# EAGLE schematic BMS Segment rev15 (EAGLE 9.6.2)
ENGINEER: Arvind Srinivasan

## Sheet 1 of 4: Upper 9 Cell Connections and Cell Voltage Test Connection
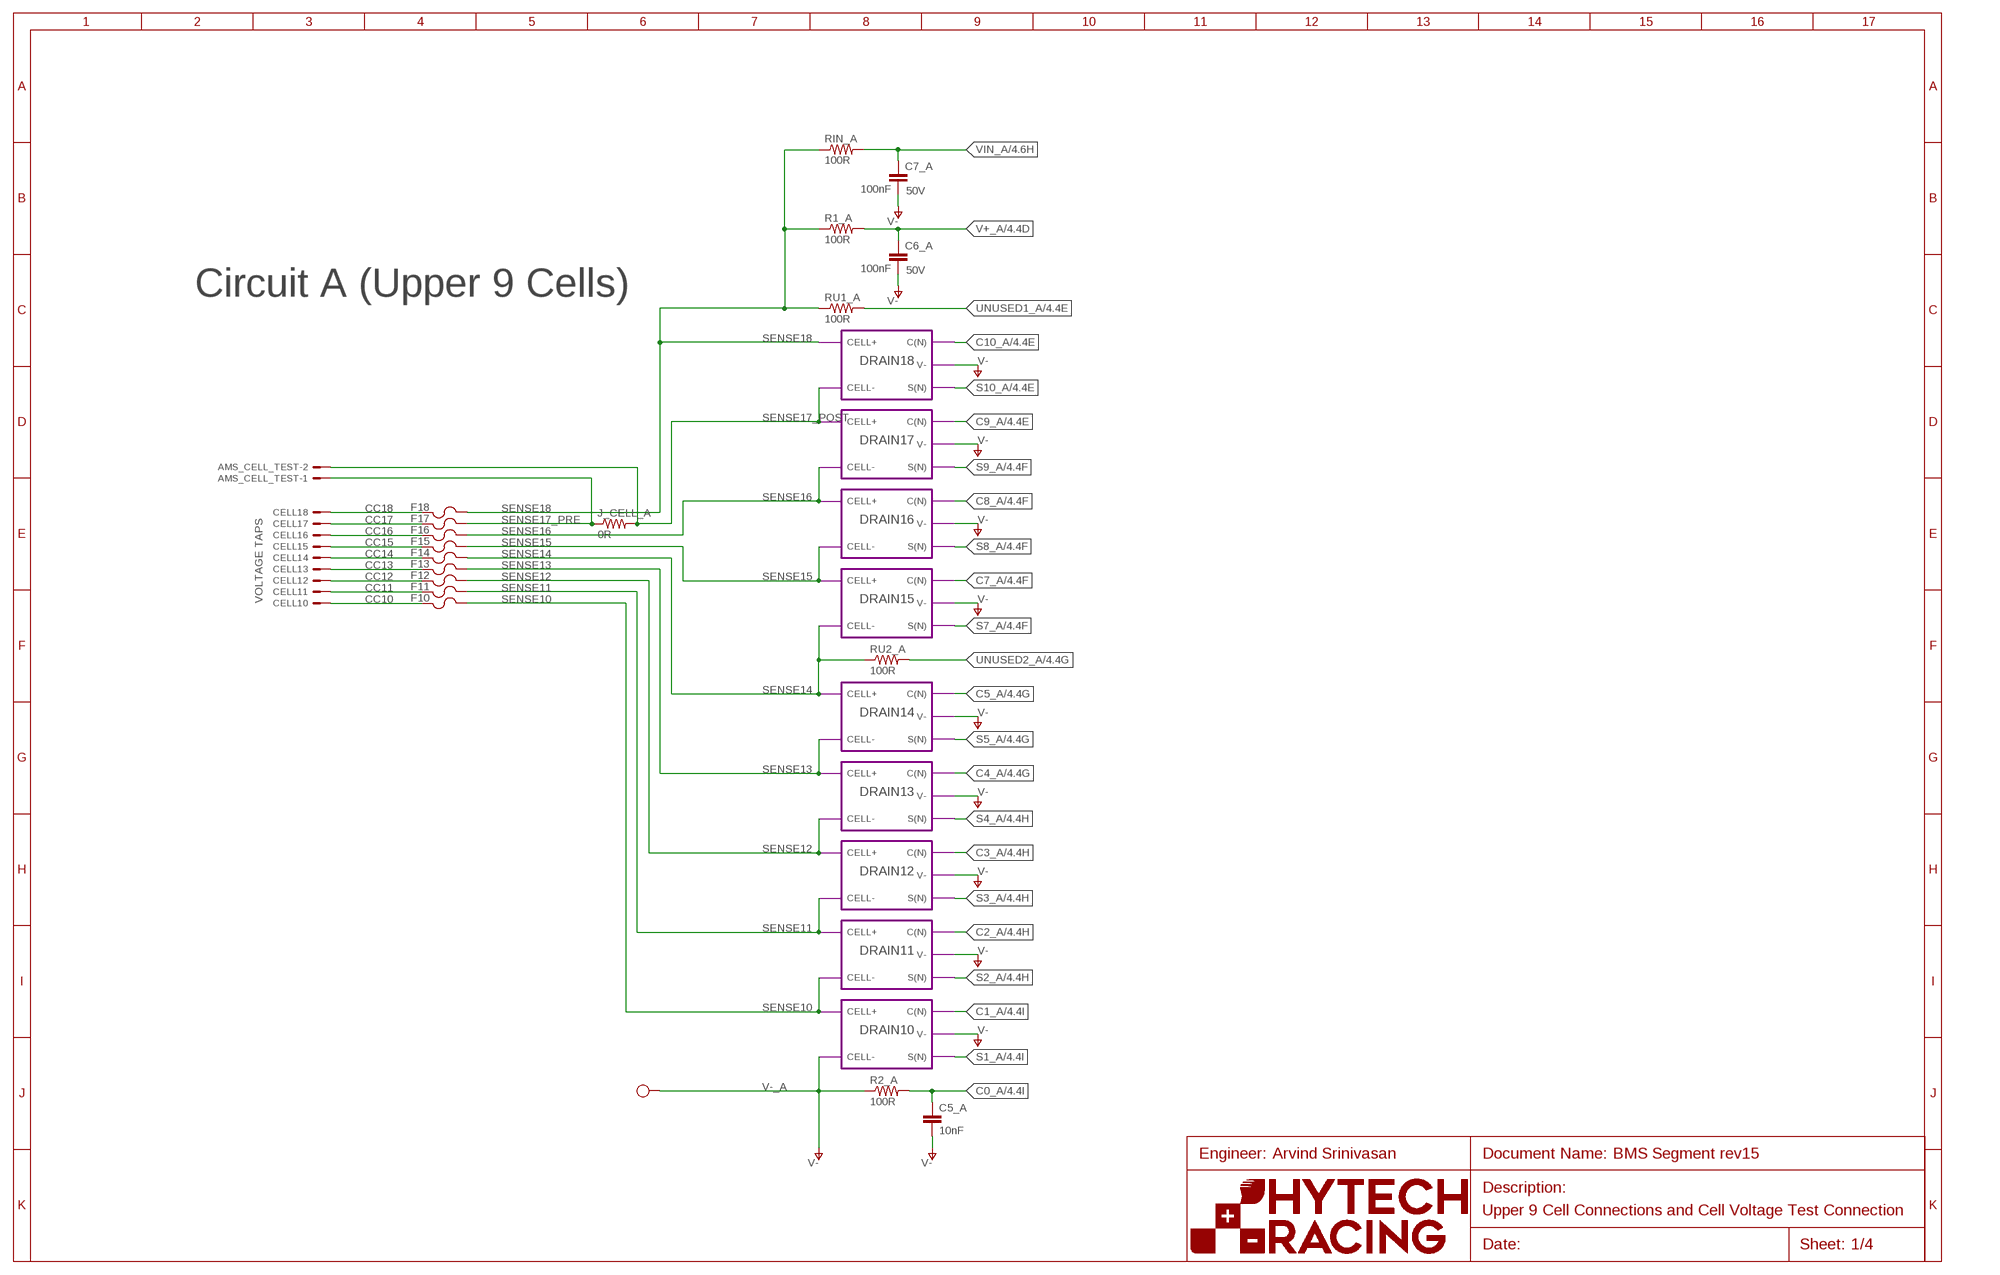
[diagram p0: schematic, sheet 1]
U$24 (FRAME_B): ENGINEER: Arvind Srinivasan; FRAME_DESCRIPTION: Upper 9 Cell Connections and Cell Voltage Test Connection; ORIENTATION: LANDSCAPE; SIZE: B

### Parts
AMS_CELL_TEST  AMS_CELL_TEST  CONNECTOR-2NANO-FIT_VERTICAL-2  [NANO-FIT_VERTICAL-2]
C5_A  10nF  CAP0603-CAP  [0603-CAP]
C6_A  100nF  CAP0603-CAP  [0603-CAP]
C7_A  100nF  CAP0603-CAP  [0603-CAP]
CELL10  BATTERY_SPRING_SPRING_CONTACT  [CONTACT_SPRING]
CELL11  BATTERY_SPRING_SPRING_CONTACT  [CONTACT_SPRING]
CELL12  BATTERY_SPRING_SPRING_CONTACT  [CONTACT_SPRING]
CELL13  BATTERY_SPRING_SPRING_CONTACT  [CONTACT_SPRING]
CELL14  BATTERY_SPRING_SPRING_CONTACT  [CONTACT_SPRING]
CELL15  BATTERY_SPRING_SPRING_CONTACT  [CONTACT_SPRING]
CELL16  BATTERY_SPRING_SPRING_CONTACT  [CONTACT_SPRING]
CELL17  BATTERY_SPRING_SPRING_CONTACT  [CONTACT_SPRING]
CELL18  BATTERY_SPRING_SPRING_CONTACT  [CONTACT_SPRING]
F10  0001.2704.11  [5X20MM_FUSE]
F11  0001.2704.11  [5X20MM_FUSE]
F12  0001.2704.11  [5X20MM_FUSE]
F13  0001.2704.11  [5X20MM_FUSE]
F14  0001.2704.11  [5X20MM_FUSE]
F15  0001.2704.11  [5X20MM_FUSE]
F16  0001.2704.11  [5X20MM_FUSE]
F17  0001.2704.11  [5X20MM_FUSE]
F18  0001.2704.11  [5X20MM_FUSE]
J_CELL_A  0R  RESISTOR0603-RES  [0603-RES]
R1_A  100R  RESISTOR0603-RES  [0603-RES]
R2_A  100R  RESISTOR0603-RES  [0603-RES]
RIN_A  100R  RESISTOR0603-RES  [0603-RES]
RU1_A  100R  RESISTOR0603-RES  [0603-RES]
RU2_A  100R  RESISTOR0603-RES  [0603-RES]
U$5  TEST_POINT  [TEST_POINT]

### Module instances
DRAIN10 = CELL_VOLTAGE_FILTER+DRAIN
DRAIN11 = CELL_VOLTAGE_FILTER+DRAIN
DRAIN12 = CELL_VOLTAGE_FILTER+DRAIN
DRAIN13 = CELL_VOLTAGE_FILTER+DRAIN
DRAIN14 = CELL_VOLTAGE_FILTER+DRAIN
DRAIN15 = CELL_VOLTAGE_FILTER+DRAIN
DRAIN16 = CELL_VOLTAGE_FILTER+DRAIN
DRAIN17 = CELL_VOLTAGE_FILTER+DRAIN
DRAIN18 = CELL_VOLTAGE_FILTER+DRAIN

### Nets
C0_A: C5_A.1 R2_A.2 ; also sheet 4
C1_A: port DRAIN10.C(N) ; also sheet 4
C2_A: port DRAIN11.C(N) ; also sheet 4
C3_A: port DRAIN12.C(N) ; also sheet 4
C4_A: port DRAIN13.C(N) ; also sheet 4
C5_A: port DRAIN14.C(N) ; also sheet 4
C7_A: port DRAIN15.C(N) ; also sheet 4
C8_A: port DRAIN16.C(N) ; also sheet 4
C9_A: port DRAIN17.C(N) ; also sheet 4
C10_A: port DRAIN18.C(N) ; also sheet 4
CC10 [unfused_hv]: CELL10.P$1(S) F10.P$1
CC11 [unfused_hv]: CELL11.P$1(S) F11.P$1
CC12 [unfused_hv]: CELL12.P$1(S) F12.P$1
CC13 [unfused_hv]: CELL13.P$1(S) F13.P$1
CC14 [unfused_hv]: CELL14.P$1(S) F14.P$1
CC15 [unfused_hv]: CELL15.P$1(S) F15.P$1
CC16 [unfused_hv]: CELL16.P$1(S) F16.P$1
CC17 [unfused_hv]: CELL17.P$1(S) F17.P$1
CC18 [unfused_hv]: CELL18.P$1(S) F18.P$1
S1_A: port DRAIN10.S(N) ; also sheet 4
S2_A: port DRAIN11.S(N) ; also sheet 4
S3_A: port DRAIN12.S(N) ; also sheet 4
S4_A: port DRAIN13.S(N) ; also sheet 4
S5_A: port DRAIN14.S(N) ; also sheet 4
S7_A: port DRAIN15.S(N) ; also sheet 4
S8_A: port DRAIN16.S(N) ; also sheet 4
S9_A: port DRAIN17.S(N) ; also sheet 4
S10_A: port DRAIN18.S(N) ; also sheet 4
SENSE10: F10.P$2 ; port DRAIN10.CELL+ DRAIN11.CELL-
SENSE11: F11.P$2 ; port DRAIN11.CELL+ DRAIN12.CELL-
SENSE12: F12.P$2 ; port DRAIN12.CELL+ DRAIN13.CELL-
SENSE13: F13.P$2 ; port DRAIN13.CELL+ DRAIN14.CELL-
SENSE14: F14.P$2 RU2_A.1 ; port DRAIN14.CELL+ DRAIN15.CELL-
SENSE15: F15.P$2 ; port DRAIN15.CELL+ DRAIN16.CELL-
SENSE16: F16.P$2 ; port DRAIN16.CELL+ DRAIN17.CELL-
SENSE17_POST: AMS_CELL_TEST.P$2 J_CELL_A.2 ; port DRAIN17.CELL+ DRAIN18.CELL-
SENSE17_PRE: AMS_CELL_TEST.P$1 F17.P$2 J_CELL_A.1
SENSE18: F18.P$2 R1_A.1 RIN_A.1 RU1_A.1 ; port DRAIN18.CELL+
UNUSED1_A: RU1_A.2 ; also sheet 4
UNUSED2_A: RU2_A.2 ; also sheet 4
V+_A: C6_A.1 R1_A.2 ; also sheet 4
V-_A: C5_A.2 C6_A.2 C7_A.2 R2_A.1 U$5.P$1 ; port DRAIN18.V- DRAIN17.V- DRAIN16.V- DRAIN15.V- DRAIN14.V- DRAIN13.V- DRAIN12.V- DRAIN11.V- DRAIN10.V- DRAIN10.CELL- ; supply symbol labelled V- ; also sheet 2,4
VIN_A: C7_A.1 RIN_A.2 ; also sheet 4

### Notes on the sheet
- Circuit A (Upper 9 Cells)
- VOLTAGE TAPS

## Sheet 2 of 4: Lower 9 Cell Connections
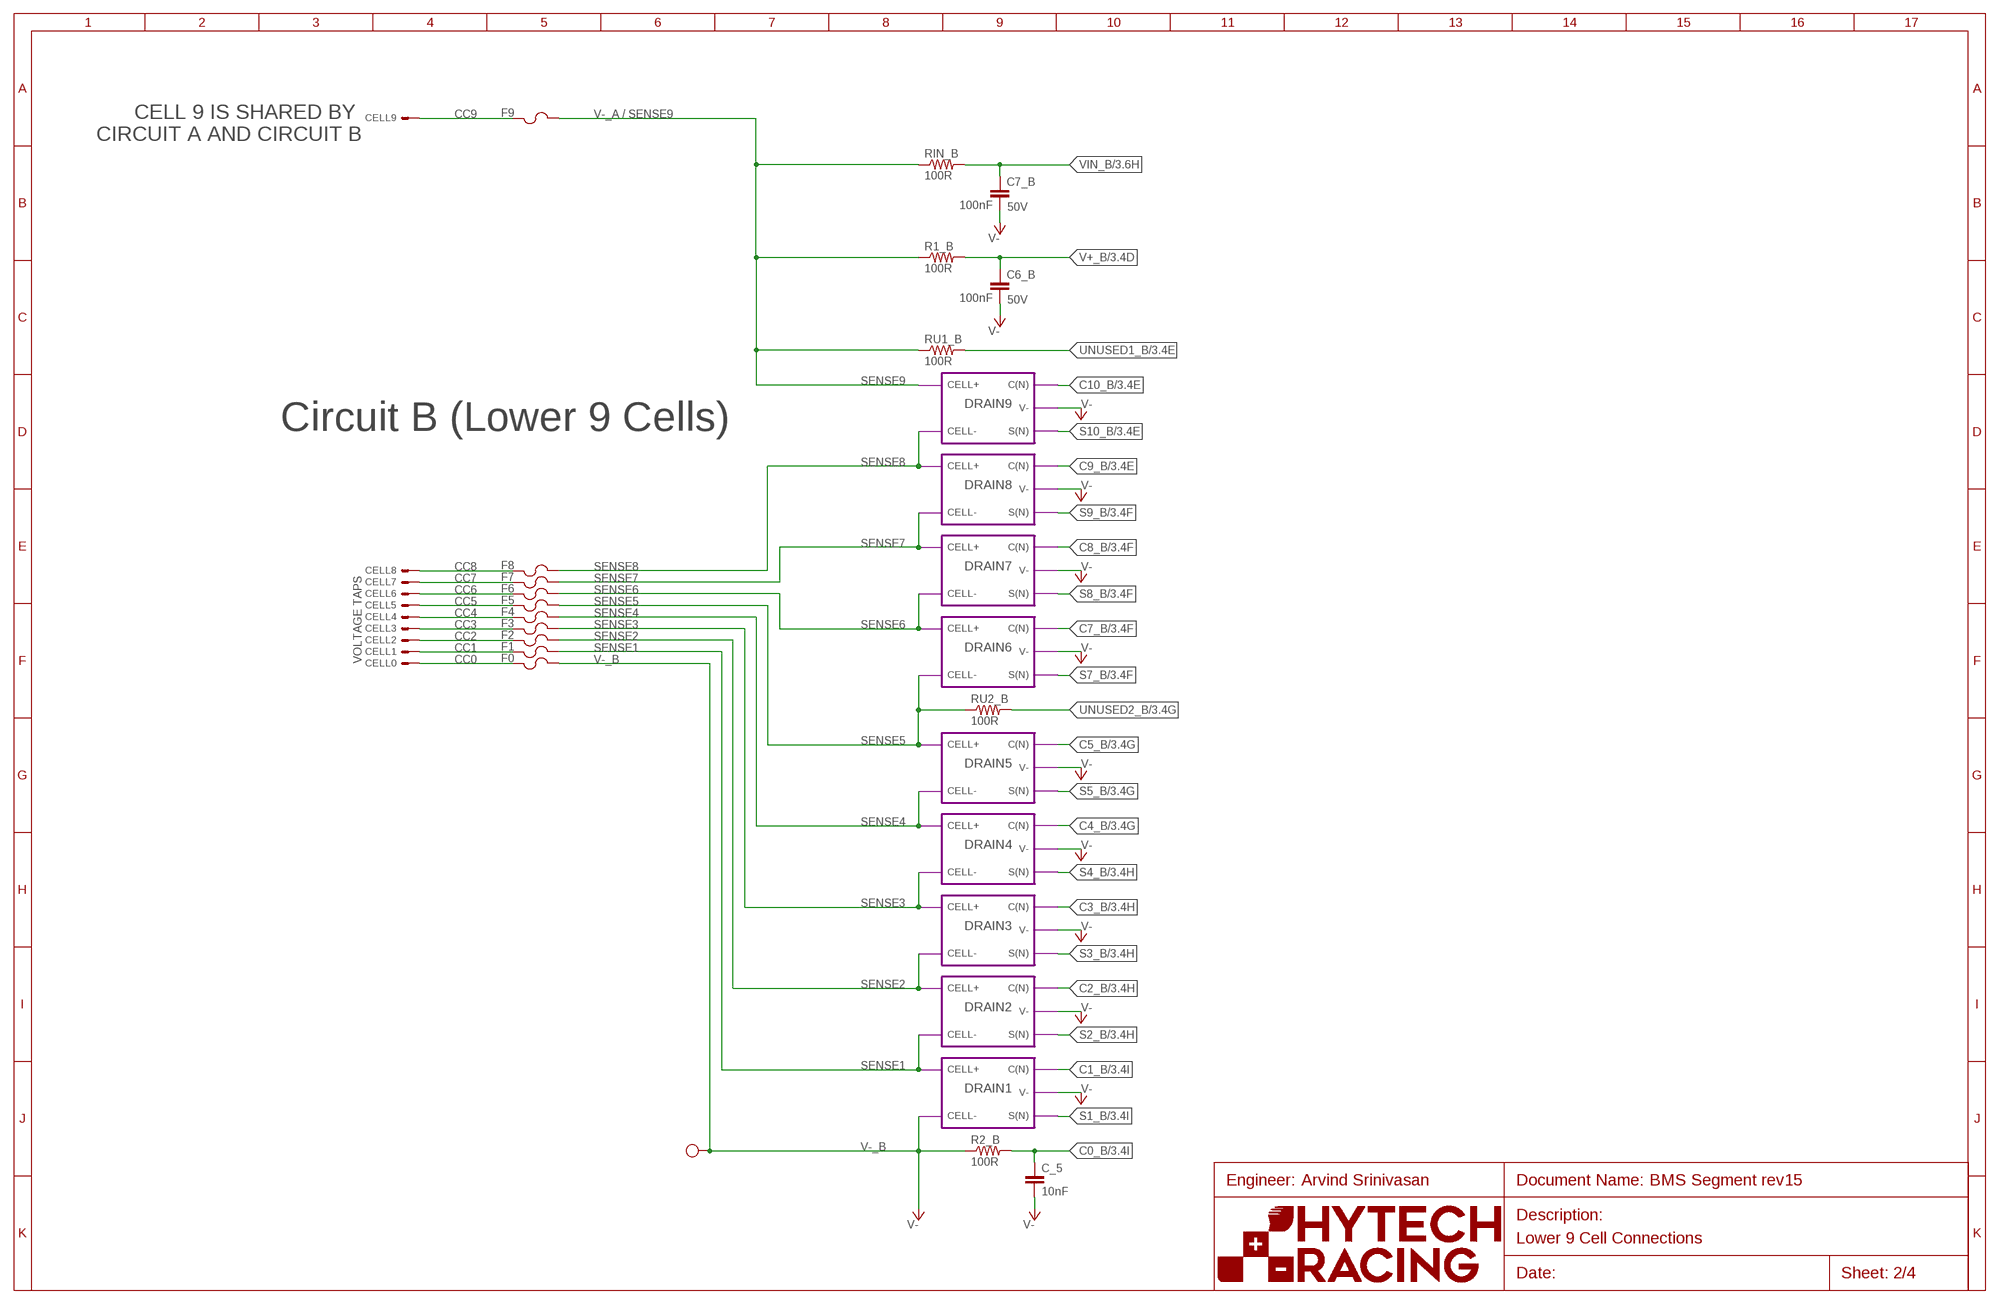
[diagram p1: schematic, sheet 2]
U$25 (FRAME_B): ENGINEER: Arvind Srinivasan; FRAME_DESCRIPTION: Lower 9 Cell Connections; ORIENTATION: LANDSCAPE; SIZE: B

### Parts
C6_B  100nF  CAP0603-CAP  [0603-CAP]
C7_B  100nF  CAP0603-CAP  [0603-CAP]
C_5  10nF  CAP0603-CAP  [0603-CAP]
CELL0  BATTERY_SPRING_SPRING_CONTACT  [CONTACT_SPRING]
CELL1  BATTERY_SPRING_SPRING_CONTACT  [CONTACT_SPRING]
CELL2  BATTERY_SPRING_SPRING_CONTACT  [CONTACT_SPRING]
CELL3  BATTERY_SPRING_SPRING_CONTACT  [CONTACT_SPRING]
CELL4  BATTERY_SPRING_SPRING_CONTACT  [CONTACT_SPRING]
CELL5  BATTERY_SPRING_SPRING_CONTACT  [CONTACT_SPRING]
CELL6  BATTERY_SPRING_SPRING_CONTACT  [CONTACT_SPRING]
CELL7  BATTERY_SPRING_SPRING_CONTACT  [CONTACT_SPRING]
CELL8  BATTERY_SPRING_SPRING_CONTACT  [CONTACT_SPRING]
CELL9  BATTERY_SPRING_SPRING_CONTACT  [CONTACT_SPRING]
F0  0001.2704.11  [5X20MM_FUSE]
F1  0001.2704.11  [5X20MM_FUSE]
F2  0001.2704.11  [5X20MM_FUSE]
F3  0001.2704.11  [5X20MM_FUSE]
F4  0001.2704.11  [5X20MM_FUSE]
F5  0001.2704.11  [5X20MM_FUSE]
F6  0001.2704.11  [5X20MM_FUSE]
F7  0001.2704.11  [5X20MM_FUSE]
F8  0001.2704.11  [5X20MM_FUSE]
F9  0001.2704.11  [5X20MM_FUSE]
R1_B  100R  RESISTOR0603-RES  [0603-RES]
R2_B  100R  RESISTOR0603-RES  [0603-RES]
RIN_B  100R  RESISTOR0603-RES  [0603-RES]
RU1_B  100R  RESISTOR0603-RES  [0603-RES]
RU2_B  100R  RESISTOR0603-RES  [0603-RES]
U$6  TEST_POINT  [TEST_POINT]

### Module instances
DRAIN1 = CELL_VOLTAGE_FILTER+DRAIN
DRAIN2 = CELL_VOLTAGE_FILTER+DRAIN
DRAIN3 = CELL_VOLTAGE_FILTER+DRAIN
DRAIN4 = CELL_VOLTAGE_FILTER+DRAIN
DRAIN5 = CELL_VOLTAGE_FILTER+DRAIN
DRAIN6 = CELL_VOLTAGE_FILTER+DRAIN
DRAIN7 = CELL_VOLTAGE_FILTER+DRAIN
DRAIN8 = CELL_VOLTAGE_FILTER+DRAIN
DRAIN9 = CELL_VOLTAGE_FILTER+DRAIN

### Nets
C0_B: C_5.1 R2_B.2 ; also sheet 3
C1_B: port DRAIN1.C(N) ; also sheet 3
C2_B: port DRAIN2.C(N) ; also sheet 3
C3_B: port DRAIN3.C(N) ; also sheet 3
C4_B: port DRAIN4.C(N) ; also sheet 3
C5_B: port DRAIN5.C(N) ; also sheet 3
C7_B: port DRAIN6.C(N) ; also sheet 3
C8_B: port DRAIN7.C(N) ; also sheet 3
C9_B: port DRAIN8.C(N) ; also sheet 3
C10_B: port DRAIN9.C(N) ; also sheet 3
CC0 [unfused_hv]: CELL0.P$1(S) F0.P$1
CC1 [unfused_hv]: CELL1.P$1(S) F1.P$1
CC2 [unfused_hv]: CELL2.P$1(S) F2.P$1
CC3 [unfused_hv]: CELL3.P$1(S) F3.P$1
CC4 [unfused_hv]: CELL4.P$1(S) F4.P$1
CC5 [unfused_hv]: CELL5.P$1(S) F5.P$1
CC6 [unfused_hv]: CELL6.P$1(S) F6.P$1
CC7 [unfused_hv]: CELL7.P$1(S) F7.P$1
CC8 [unfused_hv]: CELL8.P$1(S) F8.P$1
CC9 [unfused_hv]: CELL9.P$1(S) F9.P$1
S1_B: port DRAIN1.S(N) ; also sheet 3
S2_B: port DRAIN2.S(N) ; also sheet 3
S3_B: port DRAIN3.S(N) ; also sheet 3
S4_B: port DRAIN4.S(N) ; also sheet 3
S5_B: port DRAIN5.S(N) ; also sheet 3
S7_B: port DRAIN6.S(N) ; also sheet 3
S8_B: port DRAIN7.S(N) ; also sheet 3
S9_B: port DRAIN8.S(N) ; also sheet 3
S10_B: port DRAIN9.S(N) ; also sheet 3
SENSE1: F1.P$2 ; port DRAIN1.CELL+ DRAIN2.CELL-
SENSE2: F2.P$2 ; port DRAIN2.CELL+ DRAIN3.CELL-
SENSE3: F3.P$2 ; port DRAIN3.CELL+ DRAIN4.CELL-
SENSE4: F4.P$2 ; port DRAIN4.CELL+ DRAIN5.CELL-
SENSE5: F5.P$2 RU2_B.1 ; port DRAIN5.CELL+ DRAIN6.CELL-
SENSE6: F6.P$2 ; port DRAIN6.CELL+ DRAIN7.CELL-
SENSE7: F7.P$2 ; port DRAIN7.CELL+ DRAIN8.CELL-
SENSE8: F8.P$2 ; port DRAIN8.CELL+ DRAIN9.CELL-
UNUSED1_B: RU1_B.2 ; also sheet 3
UNUSED2_B: RU2_B.2 ; also sheet 3
V+_B: C6_B.1 R1_B.2 ; also sheet 3
V-_A: F9.P$2 R1_B.1 RIN_B.1 RU1_B.1 ; port DRAIN9.CELL+ ; also sheet 1,4
V-_B: C6_B.2 C7_B.2 C_5.2 F0.P$2 R2_B.1 U$6.P$1 ; port DRAIN1.CELL- DRAIN9.V- DRAIN8.V- DRAIN7.V- DRAIN6.V- DRAIN5.V- DRAIN4.V- DRAIN3.V- DRAIN2.V- DRAIN1.V- ; supply symbol labelled V- ; also sheet 3
VIN_B: C7_B.1 RIN_B.2 ; also sheet 3

### Notes on the sheet
- V-_A / SENSE9
- CELL 9 IS SHARED BY 
  CIRCUIT A AND CIRCUIT B
- SENSE9
- Circuit B (Lower 9 Cells)
- VOLTAGE TAPS

## Sheet 3 of 4: Upper LTC6811 IC
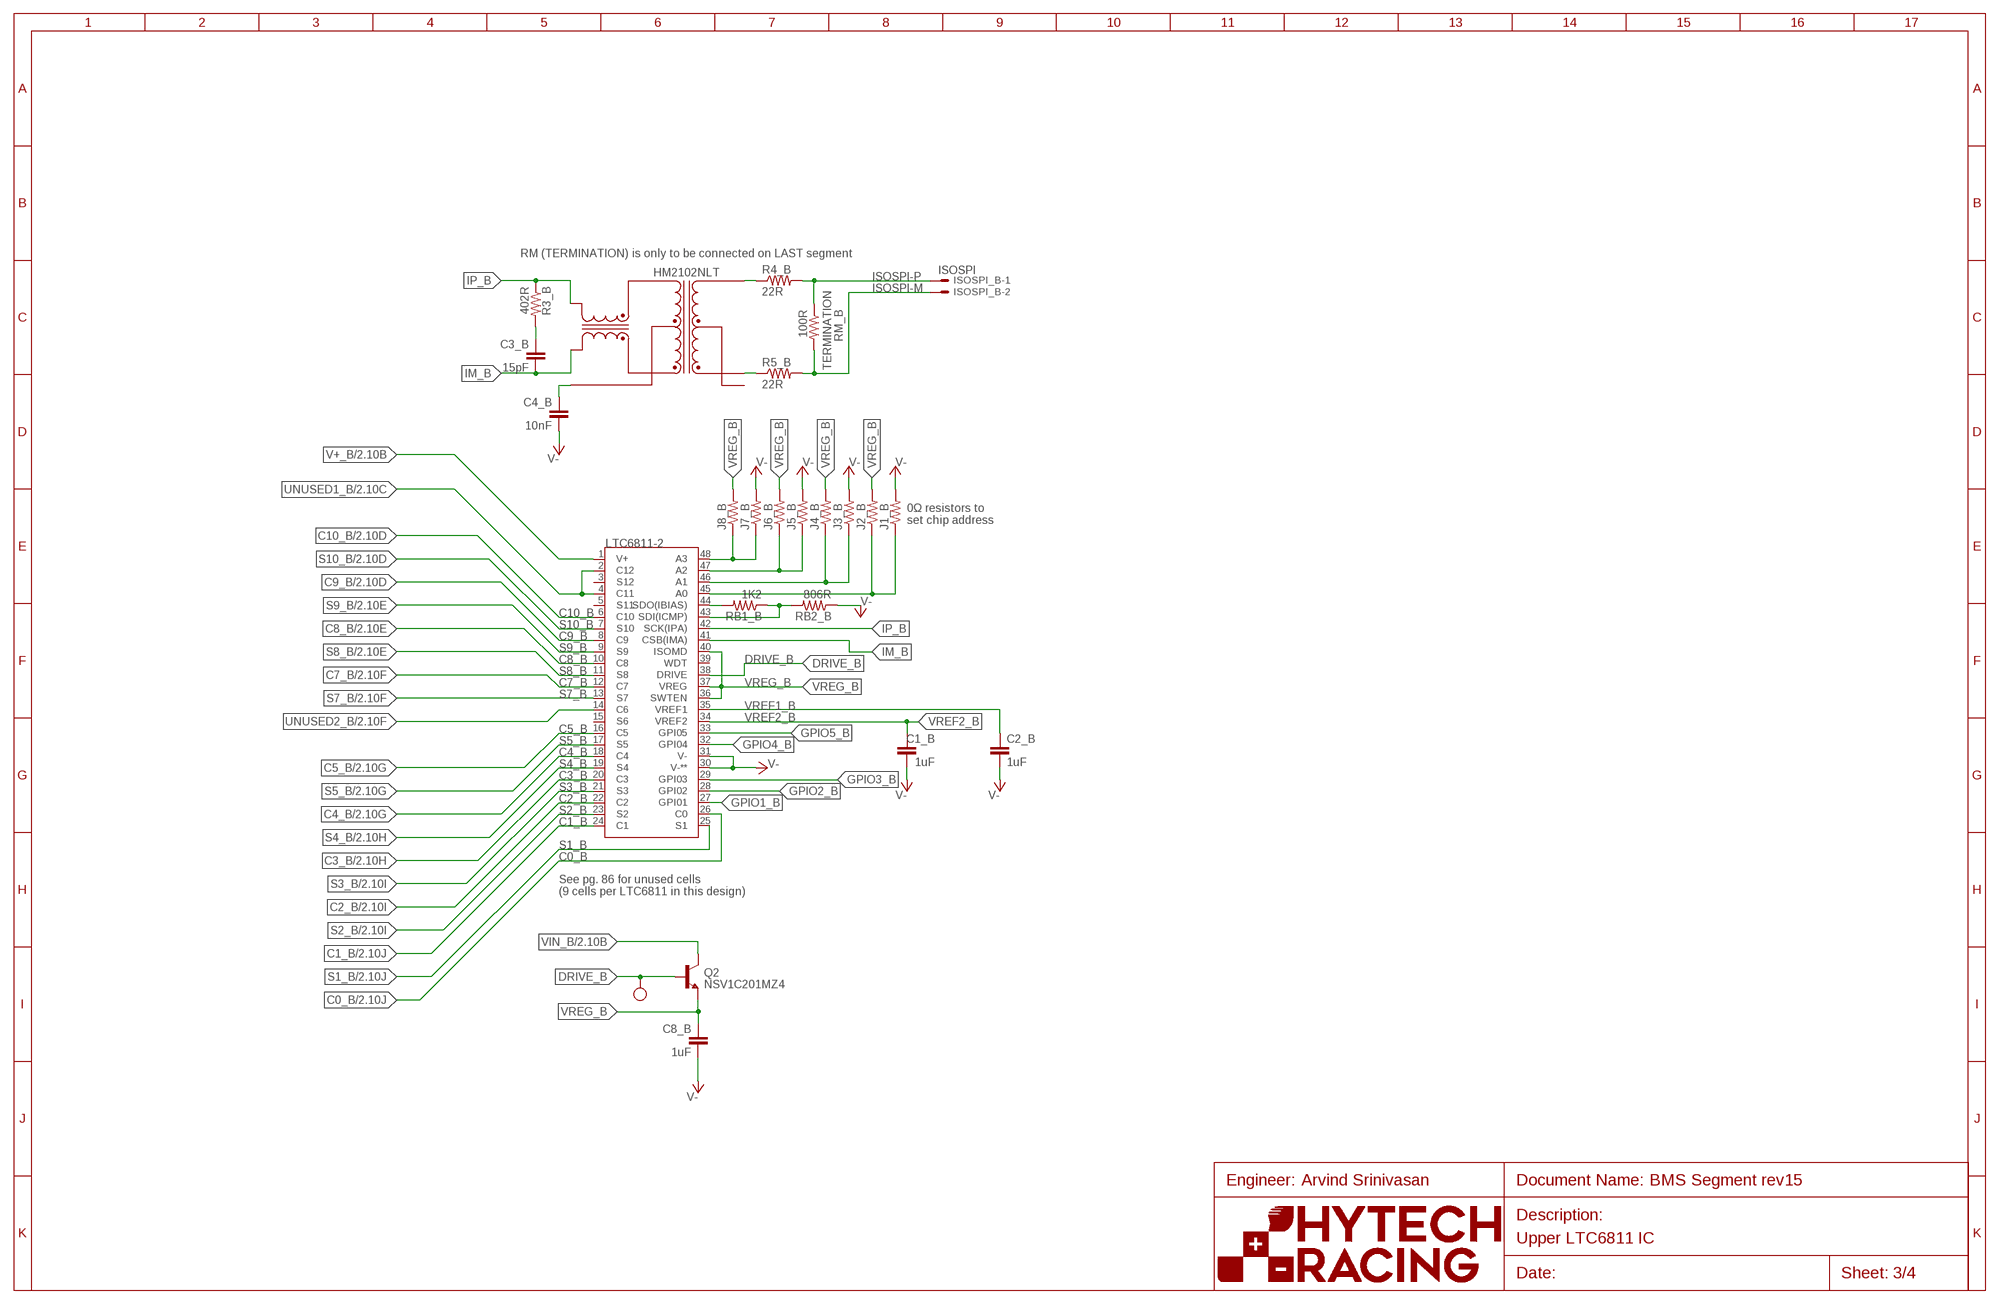
[diagram p2: schematic, sheet 3]
U$22 (FRAME_B): ENGINEER: Arvind Srinivasan; FRAME_DESCRIPTION: Upper LTC6811 IC; ORIENTATION: LANDSCAPE; SIZE: B

### Parts
C1_B  1uF  CAP0603-CAP  [0603-CAP]
C2_B  1uF  CAP0603-CAP  [0603-CAP]
C3_B  15pF  CAP0603-CAP  [0603-CAP]
C4_B  10nF  CAP0603-CAP  [0603-CAP]
C8_B  1uF  CAP0603-CAP  [0603-CAP]
ISOSPI_B  ISOSPI  CONNECTOR-2NANO-FIT_VERTICAL-2  [NANO-FIT_VERTICAL-2]
J1_B  0R  RESISTOR0603-RES  [0603-RES]
J2_B  0R  RESISTOR0603-RES  [0603-RES]
J3_B  0R  RESISTOR0603-RES  [0603-RES]
J4_B  0R  RESISTOR0603-RES  [0603-RES]
J5_B  0R  RESISTOR0603-RES  [0603-RES]
J6_B  0R  RESISTOR0603-RES  [0603-RES]
J7_B  0R  RESISTOR0603-RES  [0603-RES]
J8_B  0R  RESISTOR0603-RES  [0603-RES]
Q2  NSV1C201MZ4  [SOT223]
R3_B  402R  RESISTOR0603-RES  [0603-RES]
R4_B  22R  RESISTOR0603-RES  [0603-RES]
R5_B  22R  RESISTOR0603-RES  [0603-RES]
RB1_B  1K2  RESISTOR0603-RES  [0603-RES]
RB2_B  806R  RESISTOR0603-RES  [0603-RES]
RM_B  100R  RESISTOR0603-RES  [0603-RES]
TRANSFORMER  HM2102NLT  [HM2102NLT]
U2  LTC6811-2  [LTC6811]
U$7  TEST_POINT  [TEST_POINT]

### Nets
C0_B: U2.26(C0) ; also sheet 2
C1_B: U2.24(C1) ; also sheet 2
C2_B: U2.22(C2) ; also sheet 2
C3_B: U2.20(C3) ; also sheet 2
C4_B: U2.18(C4) ; also sheet 2
C5_B: U2.16(C5) ; also sheet 2
C7_B: U2.12(C7) ; also sheet 2
C8_B: U2.10(C8) ; also sheet 2
C9_B: U2.8(C9) ; also sheet 2
C10_B: U2.6(C10) ; also sheet 2
DRIVE_B: Q2.1(BASE) U2.38(DRIVE) U$7.P$1
GPIO1_B: U2.27(GPI01)
GPIO2_B: U2.28(GPI02)
GPIO3_B: U2.29(GPI03)
GPIO4_B: U2.32(GPI04)
GPIO5_B: U2.33(GPI05)
IM_B: C3_B.2 TRANSFORMER.P$12(TD+) U2.41(CSB(IMA))
IP_B: R3_B.1 TRANSFORMER.P$10(TD-) U2.42(SCK(IPA))
ISOSPI-M: ISOSPI_B.P$2 R5_B.2 RM_B.2 ; also sheet 4
ISOSPI-P: ISOSPI_B.P$1 R4_B.2 RM_B.1 ; also sheet 4
N$1: C4_B.1 TRANSFORMER.P$11(TCT)
N$2: RB1_B.2 U2.44(SDO(IBIAS))
N$4: RB1_B.1 RB2_B.2 U2.43(SDI(ICMP))
N$5: R4_B.1 TRANSFORMER.P$3(MX-)
N$7: R5_B.1 TRANSFORMER.P$1(MX+)
N$8: J7_B.1 J8_B.1 U2.48(A3)
N$9: J5_B.1 J6_B.1 U2.47(A2)
N$10: C3_B.1 R3_B.2
N$13: J3_B.1 J4_B.1 U2.46(A1)
N$16: J1_B.1 J2_B.1 U2.45(A0)
S1_B: U2.25(S1) ; also sheet 2
S2_B: U2.23(S2) ; also sheet 2
S3_B: U2.21(S3) ; also sheet 2
S4_B: U2.19(S4) ; also sheet 2
S5_B: U2.17(S5) ; also sheet 2
S7_B: U2.13(S7) ; also sheet 2
S8_B: U2.11(S8) ; also sheet 2
S9_B: U2.9(S9) ; also sheet 2
S10_B: U2.7(S10) ; also sheet 2
UNUSED1_B: U2.2(C12) U2.4(C11) ; also sheet 2
UNUSED2_B: U2.14(C6) ; also sheet 2
V+_B: U2.1(V+) ; also sheet 2
V-_B: C1_B.2 C2_B.2 C4_B.2 C8_B.2 J1_B.2 J3_B.2 J5_B.2 J7_B.2 RB2_B.1 U2.30(V-**) U2.31(V-) ; supply symbol labelled V- ; also sheet 2
VIN_B: Q2.2(COLLECTOR) Q2.4(COLLECTOR) ; also sheet 2
VREF1_B: C2_B.1 U2.35(VREF1)
VREF2_B: C1_B.1 U2.34(VREF2)
VREG_B: C8_B.1 J2_B.2 J4_B.2 J6_B.2 J8_B.2 Q2.3(EMITTER) U2.36(SWTEN) U2.37(VREG) U2.40(ISOMD)
Unconnected: TRANSFORMER.P$2(MCT) U2.3(S12) U2.5(S11) U2.15(S6) U2.39(WDT)

### Notes on the sheet
- RM (TERMINATION) is only to be connected on LAST segment
- 0Ω resistors to
  set chip address
- LTC6811-2
- See pg. 86 for unused cells
  (9 cells per LTC6811 in this design)

## Sheet 4 of 4: Lower LTC6811 IC and Cell Thermistor Test Connection
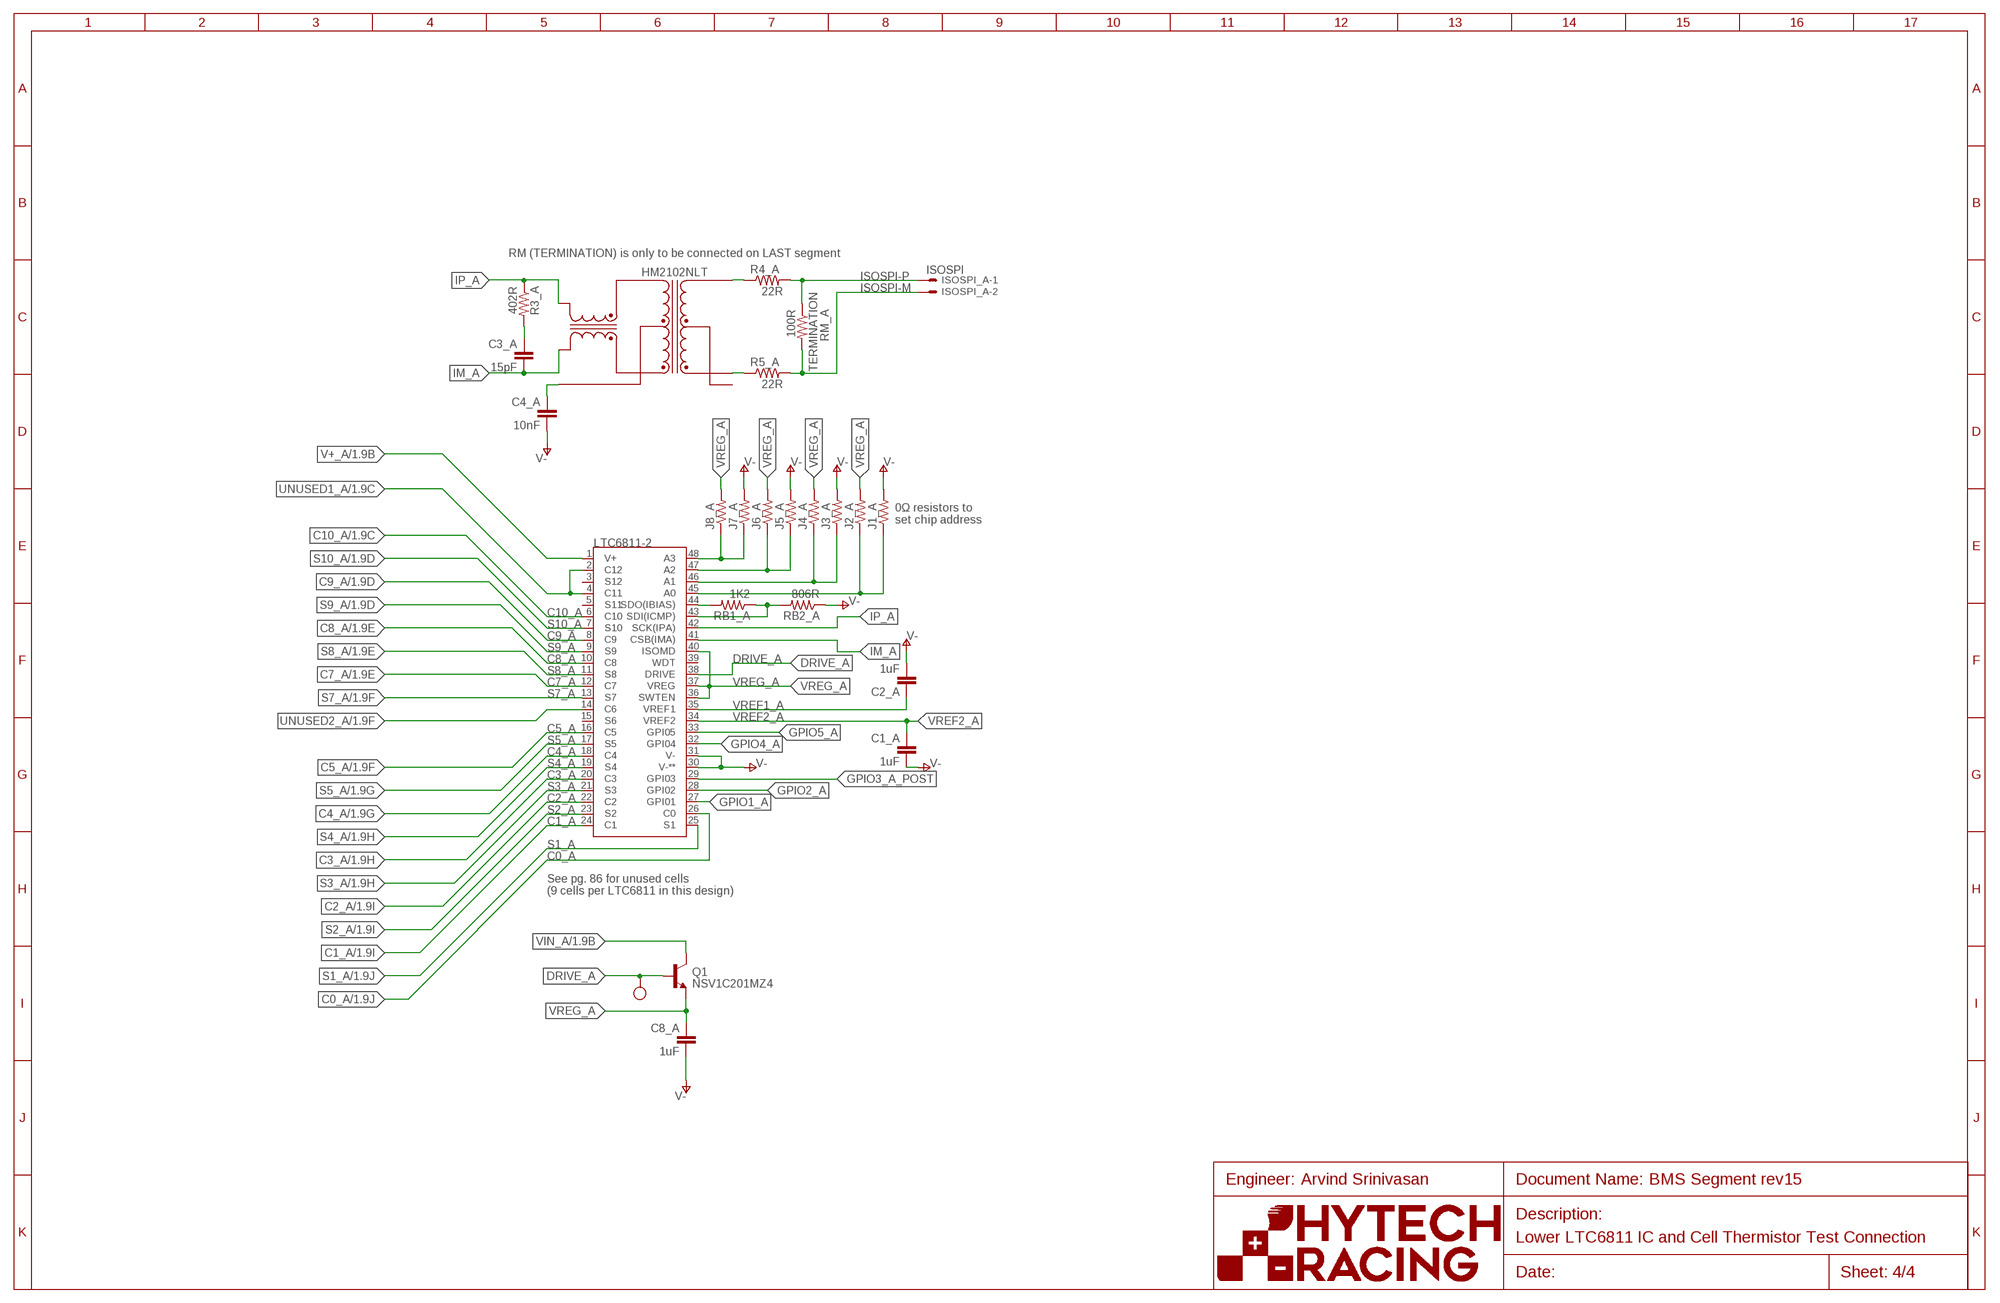
[diagram p3: schematic, sheet 4]
U$23 (FRAME_B): ENGINEER: Arvind Srinivasan; FRAME_DESCRIPTION: Lower LTC6811 IC and Cell Thermistor Test Connection; ORIENTATION: LANDSCAPE; SIZE: B

### Parts
C1_A  1uF  CAP0603-CAP  [0603-CAP]
C2_A  1uF  CAP0603-CAP  [0603-CAP]
C3_A  15pF  CAP0603-CAP  [0603-CAP]
C4_A  10nF  CAP0603-CAP  [0603-CAP]
C8_A  1uF  CAP0603-CAP  [0603-CAP]
ISOSPI_A  ISOSPI  CONNECTOR-2NANO-FIT_VERTICAL-2  [NANO-FIT_VERTICAL-2]
J1_A  0R  RESISTOR0603-RES  [0603-RES]
J2_A  0R  RESISTOR0603-RES  [0603-RES]
J3_A  0R  RESISTOR0603-RES  [0603-RES]
J4_A  0R  RESISTOR0603-RES  [0603-RES]
J5_A  0R  RESISTOR0603-RES  [0603-RES]
J6_A  0R  RESISTOR0603-RES  [0603-RES]
J7_A  0R  RESISTOR0603-RES  [0603-RES]
J8_A  0R  RESISTOR0603-RES  [0603-RES]
Q1  NSV1C201MZ4  [SOT223]
R3_A  402R  RESISTOR0603-RES  [0603-RES]
R4_A  22R  RESISTOR0603-RES  [0603-RES]
R5_A  22R  RESISTOR0603-RES  [0603-RES]
RB1_A  1K2  RESISTOR0603-RES  [0603-RES]
RB2_A  806R  RESISTOR0603-RES  [0603-RES]
RM_A  100R  RESISTOR0603-RES  [0603-RES]
U1  LTC6811-2  [LTC6811]
U$8  TEST_POINT  [TEST_POINT]

### Nets
C0_A: U1.26(C0) ; also sheet 1
C1_A: U1.24(C1) ; also sheet 1
C2_A: U1.22(C2) ; also sheet 1
C3_A: U1.20(C3) ; also sheet 1
C4_A: U1.18(C4) ; also sheet 1
C5_A: U1.16(C5) ; also sheet 1
C7_A: U1.12(C7) ; also sheet 1
C8_A: U1.10(C8) ; also sheet 1
C9_A: U1.8(C9) ; also sheet 1
C10_A: U1.6(C10) ; also sheet 1
DRIVE_A: Q1.1(BASE) U1.38(DRIVE) U$8.P$1
GPIO1_A: U1.27(GPI01)
GPIO2_A: U1.28(GPI02)
GPIO3_A_POST: U1.29(GPI03)
GPIO4_A: U1.32(GPI04)
GPIO5_A: U1.33(GPI05)
IM_A: C3_A.2 TRANSFORMER.P$9(TD+) U1.41(CSB(IMA))
IP_A: R3_A.1 TRANSFORMER.P$7(TD-) U1.42(SCK(IPA))
ISOSPI-M: ISOSPI_A.P$2 R5_A.2 RM_A.2 ; also sheet 3
ISOSPI-P: ISOSPI_A.P$1 R4_A.2 RM_A.1 ; also sheet 3
N$6: RB1_A.2 U1.44(SDO(IBIAS))
N$20: RB1_A.1 RB2_A.2 U1.43(SDI(ICMP))
N$21: C4_A.1 TRANSFORMER.P$8(TCT)
N$22: R4_A.1 TRANSFORMER.P$6(MX-)
N$23: R5_A.1 TRANSFORMER.P$4(MX+)
N$24: C3_A.1 R3_A.2
N$30: J7_A.1 J8_A.1 U1.48(A3)
N$31: J5_A.1 J6_A.1 U1.47(A2)
N$32: J3_A.1 J4_A.1 U1.46(A1)
N$33: J1_A.1 J2_A.1 U1.45(A0)
S1_A: U1.25(S1) ; also sheet 1
S2_A: U1.23(S2) ; also sheet 1
S3_A: U1.21(S3) ; also sheet 1
S4_A: U1.19(S4) ; also sheet 1
S5_A: U1.17(S5) ; also sheet 1
S7_A: U1.13(S7) ; also sheet 1
S8_A: U1.11(S8) ; also sheet 1
S9_A: U1.9(S9) ; also sheet 1
S10_A: U1.7(S10) ; also sheet 1
UNUSED1_A: U1.2(C12) U1.4(C11) ; also sheet 1
UNUSED2_A: U1.14(C6) ; also sheet 1
V+_A: U1.1(V+) ; also sheet 1
V-_A: C1_A.2 C2_A.2 C4_A.2 C8_A.2 J1_A.2 J3_A.2 J5_A.2 J7_A.2 RB2_A.1 U1.30(V-**) U1.31(V-) ; supply symbol labelled V- ; also sheet 1,2
VIN_A: Q1.2(COLLECTOR) Q1.4(COLLECTOR) ; also sheet 1
VREF1_A: C2_A.1 U1.35(VREF1)
VREF2_A: C1_A.1 U1.34(VREF2)
VREG_A: C8_A.1 J2_A.2 J4_A.2 J6_A.2 J8_A.2 Q1.3(EMITTER) U1.36(SWTEN) U1.37(VREG) U1.40(ISOMD)
Unconnected: TRANSFORMER.P$5(MCT) U1.3(S12) U1.5(S11) U1.15(S6) U1.39(WDT)

### Notes on the sheet
- RM (TERMINATION) is only to be connected on LAST segment
- 0Ω resistors to
  set chip address
- LTC6811-2
- See pg. 86 for unused cells
  (9 cells per LTC6811 in this design)

## Library data of the parts
AMS_CELL_TEST ISOSPI_A ISOSPI_B = HyTechDevices:CONNECTOR-2: Mini-Fit Junior connector 2 pole Source: http://www.molex.com
C1_A C1_B C2_A C2_B C3_A C3_B C4_A C4_B C5_A C8_A C8_B C_5 = HyTechDevices:CAP: Capacitor Standard 0603 ceramic capacitor, and 0.1" leaded capacitor.; TOLERANCE: 5%; VOLTAGE: 10V
C6_A C6_B C7_A C7_B = HyTechDevices:CAP: Capacitor Standard 0603 ceramic capacitor, and 0.1" leaded capacitor.; TOLERANCE: 5%; VOLTAGE: 50V
CELL0 CELL1-CELL18 = HyTechDevices:BATTERY_SPRING: Keystone Electronics Battery Spring Contact Datasheet <http://keyelco.com/userAssets/file/M65p17.pdf> Mill-Max Pogo Pins Datasheet <https://www.mill-max.com/catalog/download/2019-08%3A019.6M.pdf>
F0 F1-F18 = HyTechDevices:0001.2704.11: Schurter Surface Mount Ceramic Fuse Current Rating: 1A Voltage Rating AC: 250 VAC Voltage Rating DC: 300 VDC Dimensions: 5 mm x 20 mm Datasheet <http://www.mouser.com/ds/2/358/typ_SMD-SPT-46594.pdf>; RATING: 1A
J1_A J1_B J2_A J2_B J3_A J3_B J4_A J4_B J5_A J5_B J6_A J6_B J7_A J7_B J8_A J8_B J_CELL_A R1_A R1_B R2_A R2_B R3_A R3_B R4_A R4_B R5_A R5_B RB1_A RB1_B RB2_A RB2_B RIN_A RIN_B RU1_A RU1_B RU2_A RU2_B = HyTechDevices:RESISTOR: Resistor Basic schematic elements and footprints for 0603, 1206, and PTH resistors.; TOLERANCE: 1%
Q1 Q2 = HyTechDevices:NSV1C201MZ4: NPN Transistor Datasheet <http://www.onsemi.com/pub/Collateral/NSS1C201MZ4-D.PDF> MAX current: 2.0A MAX voltage: 100V
RM_A RM_B = HyTechDevices:RESISTOR: Resistor Basic schematic elements and footprints for 0603, 1206, and PTH resistors.; TOLERANCE: 1%; TYPE: TERMINATION
TRANSFORMER = HyTechDevices:HM2102NLT: 2 Channel SMT Transformer Turns ratio: 1CT: 1CT Isolation Voltage: 4300 VDC Inductance: 150 uH Leakage Inductance: 0.50 uH max DataSheet <https://www.mouser.com/datasheet/2/336/HM2102NL-1218600.pdf>
U1 U2 = HyTechDevices:LTC6811-2: Linear Technology Multicell Battery Stack Monitor Variant 2: Addressable/Multi-Drop Configuration Datasheet <http://cds.linear.com/docs/en/datasheet/680412fc.pdf>
U$5-U$8 = HyTechDevices:TEST_POINT: Keystone Electronics Test Point 5005

## Module CELL_VOLTAGE_FILTER+DRAIN
Ports: CELL+(in) CELL-(pas) S(N)(in) C(N)(out) V-(pwr)
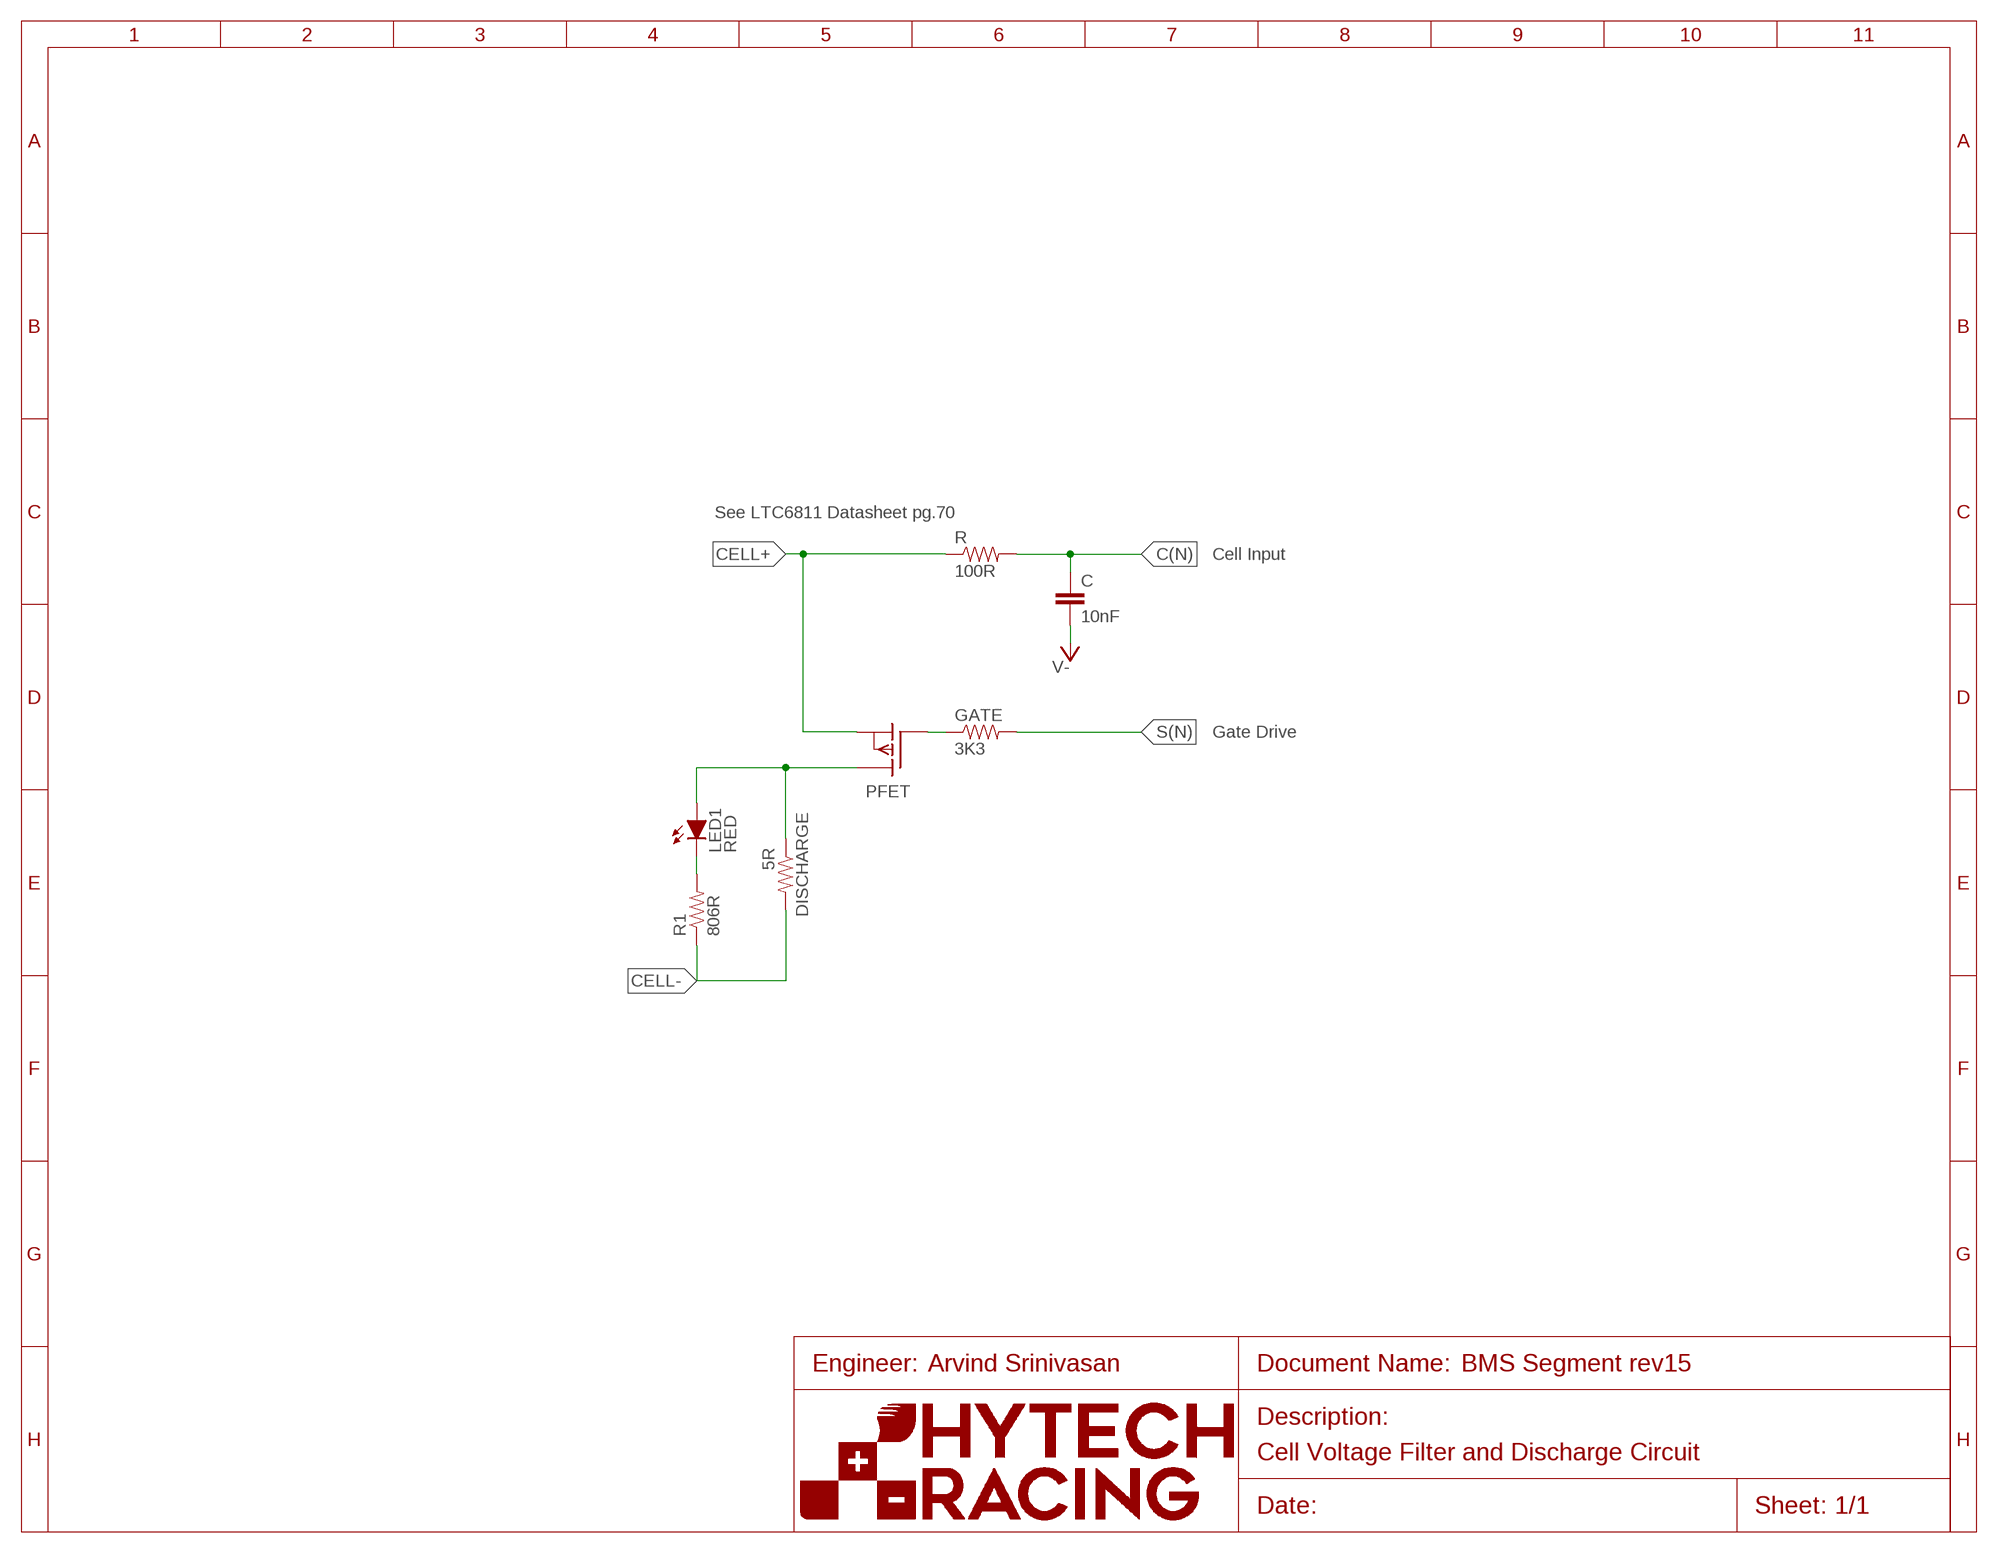
[diagram p4: schematic, module CELL_VOLTAGE_FILTER+DRAIN, sheet 1]
U$1 (FRAME_A): FRAME_DESCRIPTION: Default; ORIENTATION: LANDSCAPE; SIZE: A

### Parts
C  10nF  CAP0603-CAP  [0603-CAP]
DISCHARGE  5R  RESISTORPWR163  [PWR163]
GATE  3K3  RESISTOR0603-RES  [0603-RES]
LED1  RED  LED-0603  [LED-603]
PFET  P-CHANNEL_MOSFET_DMP3099L-7  [SOT23]
R  100R  RESISTOR0603-RES  [0603-RES]
R1  806R  RESISTOR0603-RES  [0603-RES]

### Nets
C(N): C.1 R.2
CELL+: PFET.2(S) R.1
CELL-: DISCHARGE.2 R1.1
GATE: GATE.1 PFET.1(G)
N$1: DISCHARGE.1 LED1.A PFET.3(D)
N$2: LED1.C R1.2
S(N): GATE.2
V-: C.2

### Notes on the sheet
- See LTC6811 Datasheet pg.70
- Cell Input
- Gate Drive
- Arvind Srinivasan
- Cell Voltage Filter and Discharge Circuit

### Library data of the parts
C = HyTechDevices:CAP: Capacitor Standard 0603 ceramic capacitor, and 0.1" leaded capacitor.; TOLERANCE: 5%; VOLTAGE: 10V
DISCHARGE = HyTechDevices:RESISTOR: Resistor Basic schematic elements and footprints for 0603, 1206, and PTH resistors.; TOLERANCE: 5%
GATE R R1 = HyTechDevices:RESISTOR: Resistor Basic schematic elements and footprints for 0603, 1206, and PTH resistors.; TOLERANCE: 1%
LED1 = HyTechDevices:LED: Light Emitting Diode (LED) Source: Dangerous Prototypes Eagle Library <https://github.com/DangerousPrototypes/Eagle_Part_Library>; DKPN: 350-2038-1-ND
PFET = HyTechDevices:P-CHANNEL_MOSFET_DMP3099L-7: Diodes Incorporated P-Channel Enhancement Mode MOSFET Datasheet <http://www.mouser.com/ds/2/115/DMP3099L-266220.pdf>

## Module CELL_THERM_FILTER
Ports: VREF(pwr) GPIO(out) THERM(in) V-(pwr)
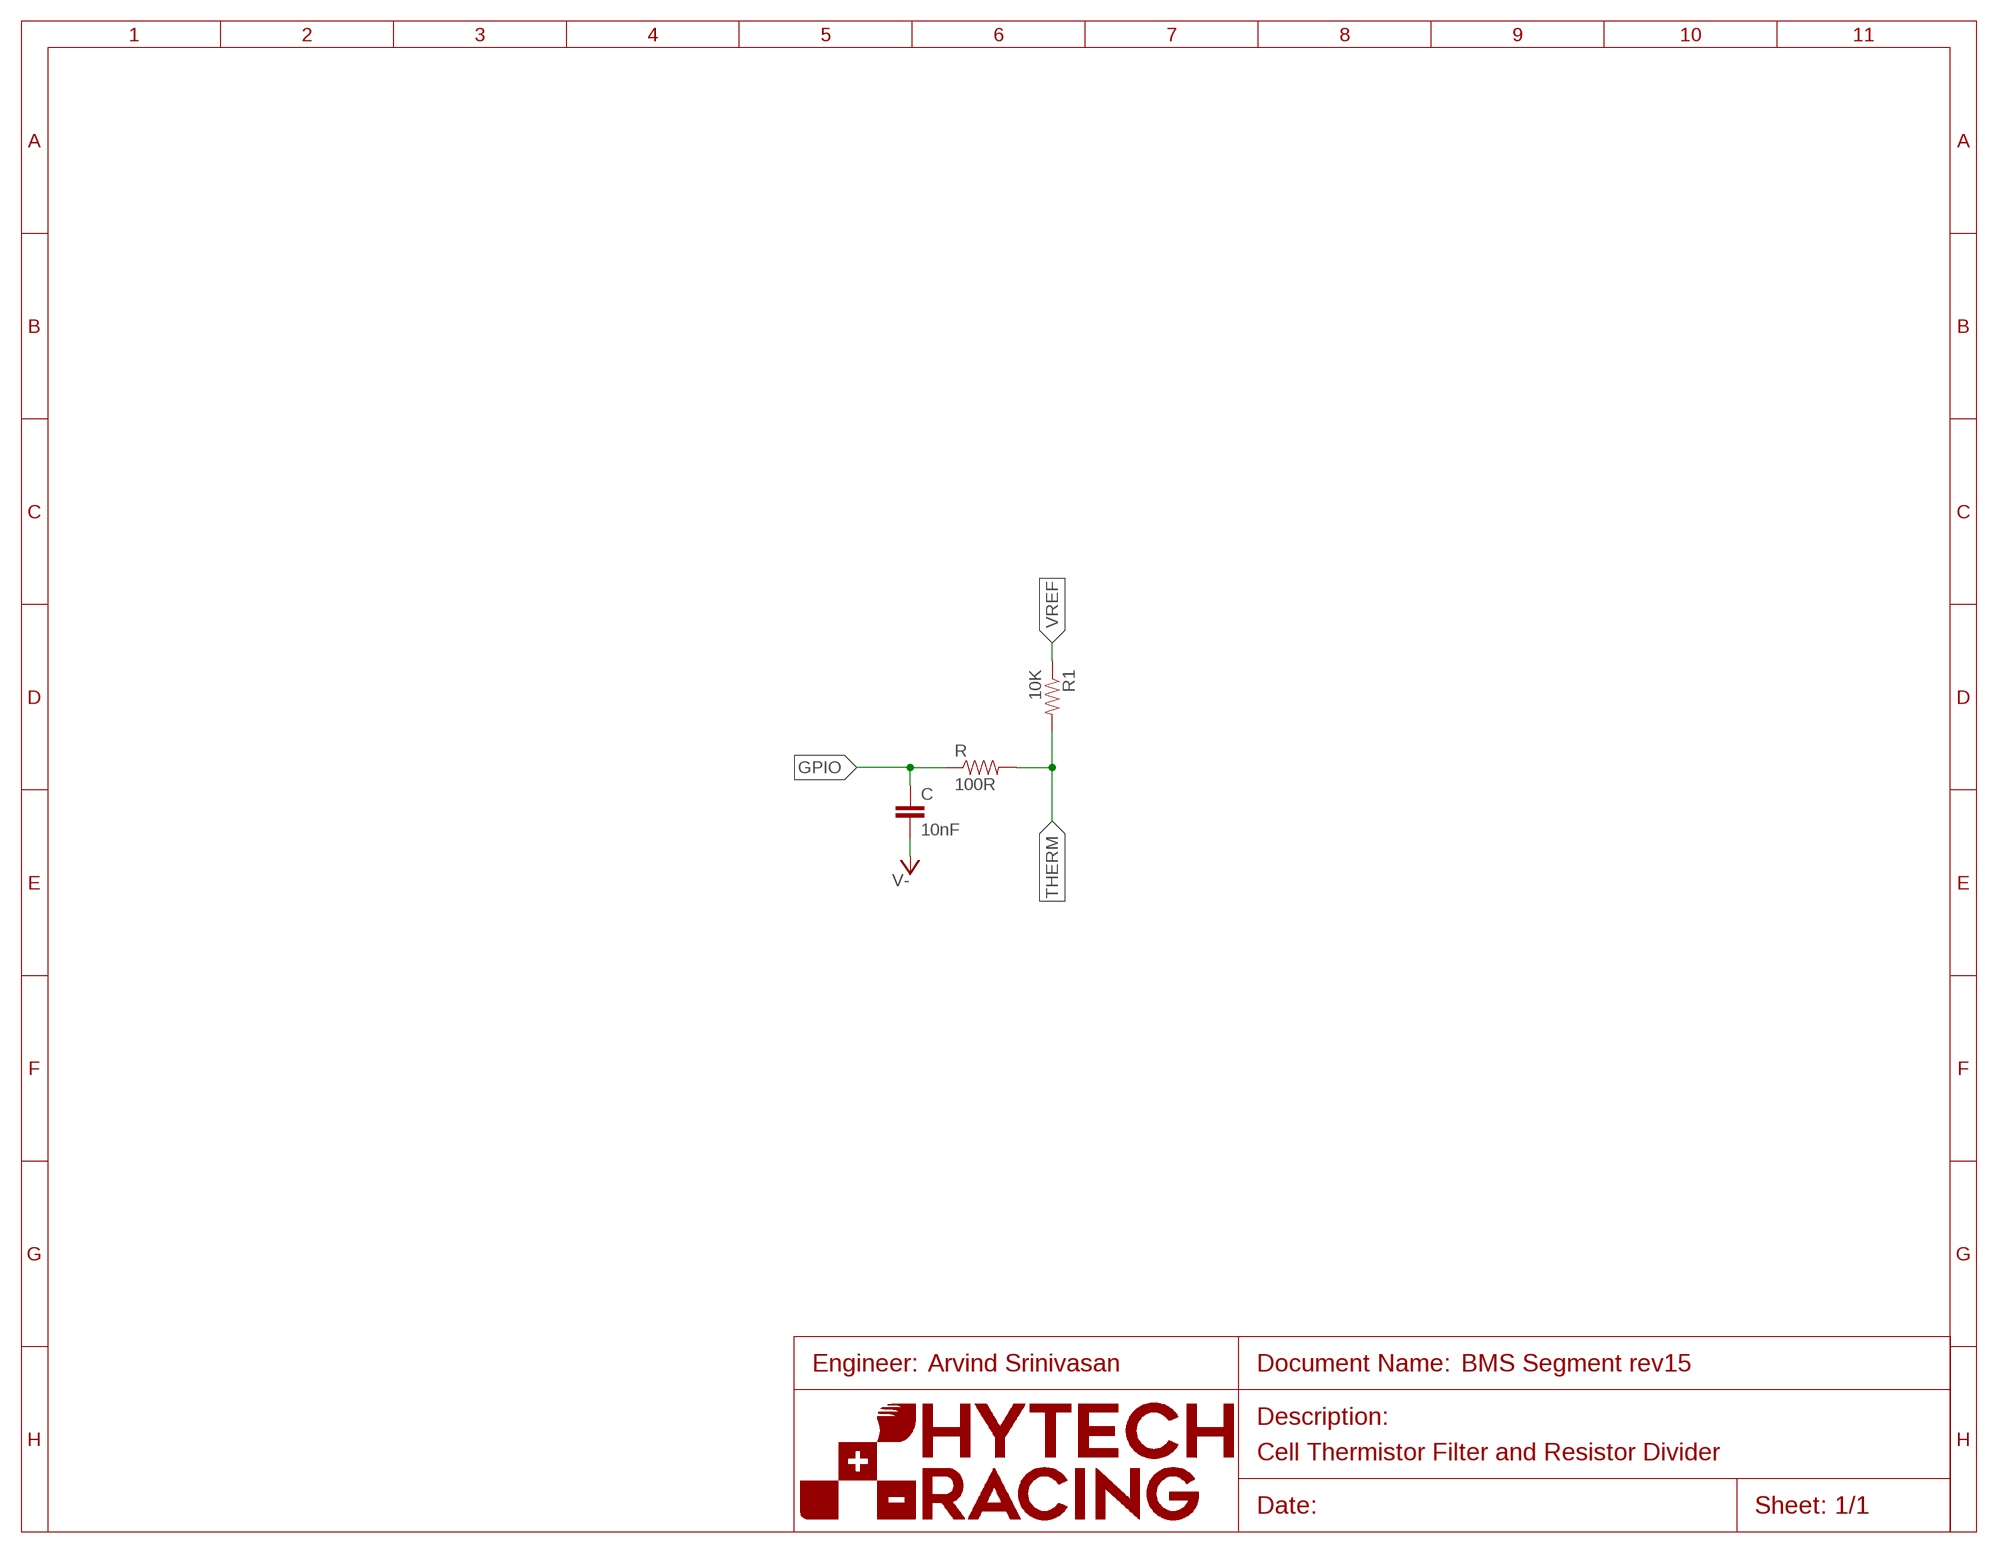
[diagram p5: schematic, module CELL_THERM_FILTER, sheet 1]
U$1 (FRAME_A): FRAME_DESCRIPTION: Default; ORIENTATION: LANDSCAPE; SIZE: A

### Parts
C  10nF  CAP0603-CAP  [0603-CAP]
R  100R  RESISTOR0603-RES  [0603-RES]
R1  10K  RESISTOR0603-RES  [0603-RES]

### Nets
GPIO: C.1 R.1
THERM: R1.2 R.2
V-: C.2
VREF: R1.1

### Notes on the sheet
- Arvind Srinivasan
- Cell Thermistor Filter and Resistor Divider

### Library data of the parts
C = HyTechDevices:CAP: Capacitor Standard 0603 ceramic capacitor, and 0.1" leaded capacitor.; TOLERANCE: 5%; VOLTAGE: 10V
R R1 = HyTechDevices:RESISTOR: Resistor Basic schematic elements and footprints for 0603, 1206, and PTH resistors.; TOLERANCE: 1%

## Net classes
1 unfused_hv: clearance 0.025 mm to class 0, clearance 3.2 mm